# Altium project ECE453-F22-MCU.PrjPcb (part 3 of 3)

## Sheet 05_Analog.SchDoc
size A
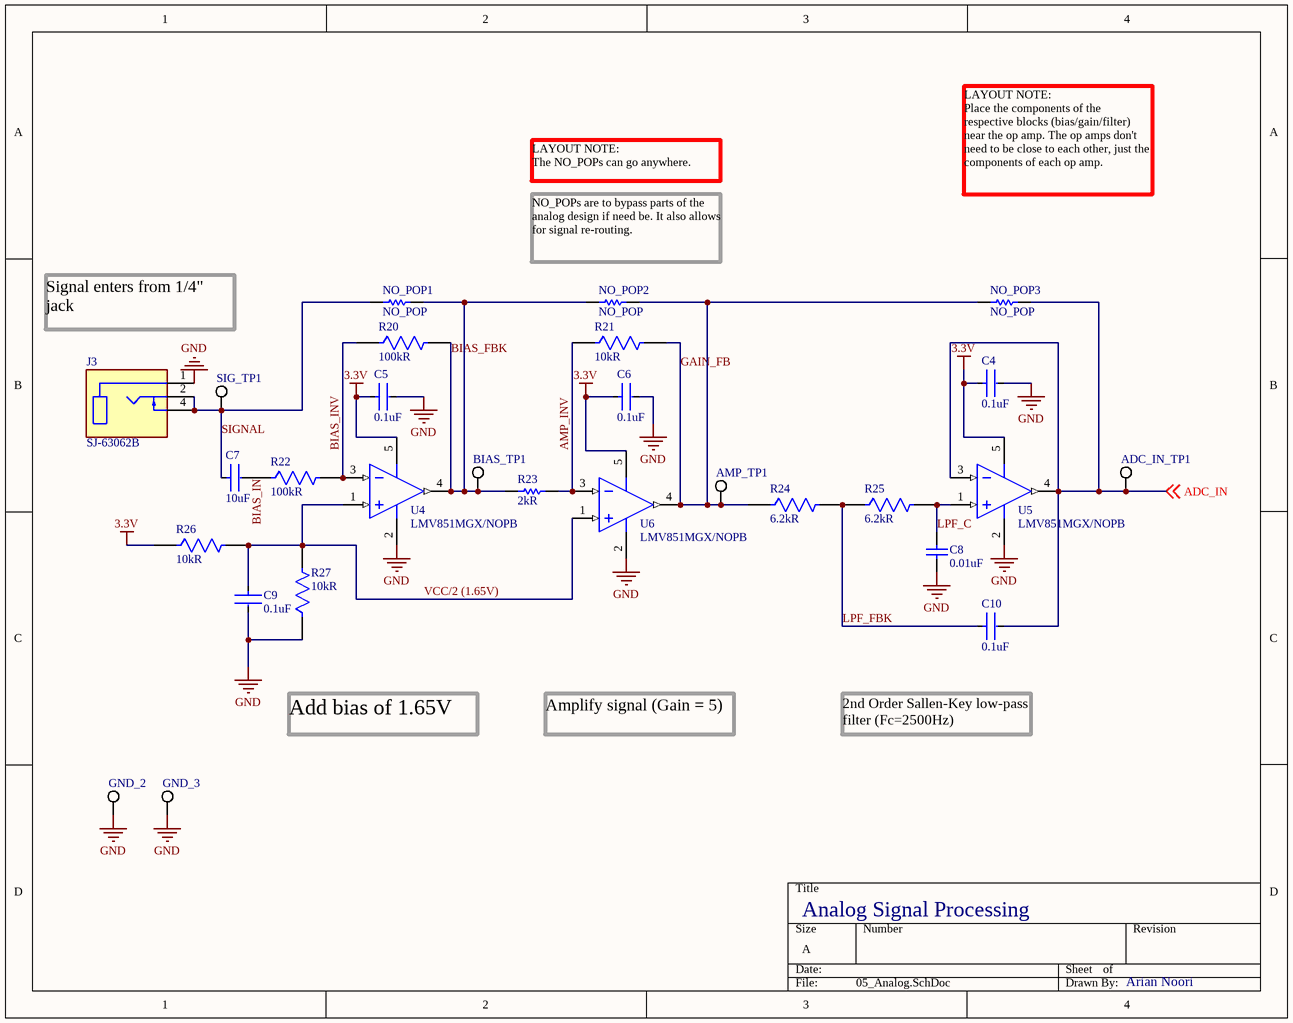
[diagram p4: 05_Analog.SchDoc]

### Parts
ADC_IN_TP1  5019  [KSTN-5019_V]  (value not drawn)
AMP_TP1  5019  [KSTN-5019_V]  (value not drawn)
BIAS_TP1  5019  [KSTN-5019_V]  (value not drawn)
C4  0.1uF  [FP-CL21-IPC_C]
C5  0.1uF  [FP-CL21-IPC_C]
C6  0.1uF  [FP-CL21-IPC_C]
C7  10uF  [FP-CL21-IPC_B]
C8  0.01uF  [CAPC2013X75X45LL10T25]
C9  0.1uF  [FP-CL21-IPC_C]
C10  0.1uF  [FP-CL21-IPC_C]
GND_2  5019  [KSTN-5019_V]  (value not drawn)
GND_3  5019  [KSTN-5019_V]  (value not drawn)
J3  SJ-63062B  [CUI_SJ-63062B]
NO_POP1  NO_POP  [RESC2013X60X35ML10T20]
NO_POP2  NO_POP  [RESC2013X60X35ML10T20]
NO_POP3  NO_POP  [RESC2013X60X35ML10T20]
R20  100kR  [FP-RT0805-MFG]
R21  10kR  [FP-RT0805-MFG]
R22  100kR  [FP-RT0805-MFG]
R23  2kR  [RESC2013X60X35LL10T20]
R24  6.2kR  [FP-RT0805-MFG]
R25  6.2kR  [FP-RT0805-MFG]
R26  10kR  [FP-RT0805-MFG]
R27  10kR  [FP-RT0805-MFG]
SIG_TP1  5019  [KSTN-5019_V]  (value not drawn)
U4  LMV851MGX/NOPB  [DCK0005A_N]
U5  LMV851MGX/NOPB  [DCK0005A_N]
U6  LMV851MGX/NOPB  [DCK0005A_N]

### Nets
3.3V: C4.1 C5.1 C6.1 R26.1 U4.5(V+) U5.5(V+) U6.5(V+)
GND: C4.2 C5.2 C6.2 C8.2 C9.2 GND_2.1 GND_3.1 J3.1(SLEEVE) R27.1 U4.2(V-) U5.2(V-) U6.2(V-)
ADC_IN: ADC_IN_TP1.1 C10.2 NO_POP3.2 U5.3(IN-) U5.4(OUT) ; off-sheet ADC_IN
AMP_INV: R21.1 R23.2 U6.3(IN-)
BIAS_FBK: BIAS_TP1.1 NO_POP1.2 NO_POP2.1 R20.2 R23.1 U4.4(OUT)
BIAS_IN: C7.2 R22.1
BIAS_INV: R20.1 R22.2 U4.3(IN-)
GAIN_FB: AMP_TP1.1 NO_POP2.2 NO_POP3.1 R21.2 R24.1 U6.4(OUT)
LPF_C: C8.1 R25.2 U5.1(IN+)
LPF_FBK: C10.1 R24.2 R25.1
SIGNAL: C7.1 J3.2(TIP) J3.4(TIP_SWITCH) NO_POP1.1 SIG_TP1.1
VCC/2 (1.65V): C9.1 R26.2 R27.2 U4.1(IN+) U6.1(IN+)

### Notes on the sheet
- LAYOUT NOTE:
  The NO_POPs can go anywhere.
- LAYOUT NOTE:
  Place the components of the respective blocks (bias/gain/filter) near the op amp. The op amps don't need to be close to each other, just the components of each op amp.
- (near NO_POP2) NO_POPs are to bypass parts of the analog design if need be. It also allows for signal re-routing.
- Signal enters from 1/4" jack
- Add bias of 1.65V
- Amplify signal (Gain = 5)
- 2nd Order Sallen-Key low-pass filter (Fc=2500Hz)
- Analog Signal Processing
- Arian Noori

### Library data of the parts
ADC_IN_TP1 AMP_TP1 BIAS_TP1 GND_2 GND_3 SIG_TP1 = CMP-1672-00008-1: Test Point, 1 Position SMD, RoHS, Tape and Reel; Manufacturer: Keystone Electronics; ComponentLink1Description: Manufacturer URL; Package Quantity: 1000; DatasheetVersion: 03/2014; Packaging: Tape and Reel; ComponentLink2URL: http://www.keyelco.com/product-pdf.cfm?p=1357; ComponentLink1URL: http://www.keyelco.com/; Mount: Surface Mount; Contact Plating: Silver; PackageDescription: 1-Pin Surface Mount Device, Body 3.81 x 2.03 mm; Pins: 1; RoHSCompliant: True; Mounting Technology: Surface Mount; ComponentLink2Description: Datasheet; PackageReference: 5019; Supplier 1: Digi-Key; Manufacturer Part Number: 5019; RoHS: Yes; Category: Connectors; Stock 1: 1295398; Pricing 1: 1=0.34000, 25=0.27360, 100=0.22340, 250=0.20064, 500=0.19152 (USD); Number of Pins: 1; Material: Bronze; Contact Material: Bronze; Termination: SMD/SMT; Series: 5019; Height: 0.09inch; REACH SVHC: No SVHC; RoHS Compliant: Yes; Lead Free: Lead Free; ComponentLink3URL: https://datasheet.ciiva.com/16318/m60-2p61-16318395.pdf?src-supplier=Future+Electronics; ComponentLink3Description: https://datasheet.ciiva.com/16318/m60-2p61-16318395.pdf?src-supplier=Future+Electronics; ComponentLink4URL: https://datasheet.ciiva.com/16885/70182998-16885945.pdf?src-supplier=Allied+Electronics; ComponentLink4Description: https://datasheet.ciiva.com/16885/70182998-16885945.pdf?src-supplier=Allied+Electronics; ComponentLink5URL: https://datasheet.ciiva.com/14848/m60-2p61-14848437.pdf?src-supplier=Digi-Key; ComponentLink5Description: https://datasheet.ciiva.com/14848/m60-2p61-14848437.pdf?src-supplier=Digi-Key; ComponentLink6URL: https://datasheet.ciiva.com/14848/m60-2p61-14848438.pdf?src-supplier=Digi-Key; ComponentLink6Description: https://datasheet.ciiva.com/14848/m60-2p61-14848438.pdf?src-supplier=Digi-Key; ComponentLink7URL: https://datasheet.ciiva.com/14848/m60-2p61-14848439.pdf?src-supplier=Digi-Key; ComponentLink7Description: https://datasheet.ciiva.com/14848/m60-2p61-14848439.pdf?src-supplier=Digi-Key
C4-C6 C9 C10 = CMP-2000-05017-2: CL21 Series 0805 100nF 50V ±10% Tolerance X7R Multilayer Ceramic Chip Capacitor; Manufacturer: Samsung; Manufacturer Part Number: CL21B104KBCNNNC; Depth: 1.25mm; Height: 0.85mm; Width: 0.049inch; Tolerance: 10%; Case Code (Metric): 2012; Case Code (Imperial): 0805; Material: Ceramic; Thickness: 0.037inch; Min Operating Temperature: -55°C; Contact Plating: Tin; Length: 2mm; Mount: Surface Mount; Voltage Rating (DC): 50V; Lead Free: Lead Free; Dielectric: X7R; Radiation Hardening: No; Capacitance: 100nF; Voltage Rating: 50V; Case/Package: 0805; Packaging: Tape and Reel; Max Operating Temperature: 125°C; Voltage: 50V; Supplier 1: Digi-Key; RoHS: Yes; Category: Ceramic Capacitors; Stock 1: 4599648; Pricing 1: 1=0.10000, 10=0.04400, 50=0.02400, 100=0.01960, 500=0.01404, 1000=0.01103 (USD); Series: CL; Construction: Flat; RoHS Compliant: Yes; ComponentLink1URL: https://datasheet.ciiva.com/25710/cl21b104kbcnnnc-25710182.pdf?src-supplier=Digi-Key; ComponentLink1Description: https://datasheet.ciiva.com/25710/cl21b104kbcnnnc-25710182.pdf?src-supplier=Digi-Key; ComponentLink2URL: https://datasheet.ciiva.com/29199/454152-da-01-en-vs-kondensator-0805-29199814.pdf?src-supplier=Conrad; ComponentLink2Description: https://datasheet.ciiva.com/29199/454152-da-01-en-vs-kondensator-0805-29199814.pdf?src-supplier=Conrad
C7 = CMP-2000-06103-2: CL21 Series 0805 10uF 10V ±10% Tolerance X5R Multilayer Ceramic Chip Capacitor; Manufacturer: Samsung; Manufacturer Part Number: CL21A106KPFNNNE; Case Code (Imperial): 0805; Capacitance: 10uF; Mount: Surface Mount; Depth: 1.25mm; Length: 2mm; Lead Free: Lead Free; Packaging: Tape and Reel; Dielectric: X5R; Width: 0.049inch; Package Quantity: 1; Height: 1.25mm; Case/Package: 0805; Voltage Rating: 10V; Thickness: 0.053inch; Max Operating Temperature: 85°C; Tolerance: 10%; Case Code (Metric): 2012; Contact Plating: Tin; Min Operating Temperature: -55°C; Radiation Hardening: No; Voltage Rating (DC): 10V; Supplier 1: Digi-Key; RoHS: Yes; Category: Ceramic Capacitors; Stock 1: 2691681; Pricing 1: 1=0.11000, 10=0.08100, 50=0.04420, 100=0.03610, 500=0.02580, 1000=0.02028 (USD); Series: CL; Construction: Flat; RoHS Compliant: Yes; ComponentLink1URL: https://media.digikey.com/pdf/Data%20Sheets/Samsung%20PDFs/CL_Series_MLCC_ds.pdf?src-supplier=Digi-Key; ComponentLink1Description: https://media.digikey.com/pdf/Data%20Sheets/Samsung%20PDFs/CL_Series_MLCC_ds.pdf?src-supplier=Digi-Key
C8 = CMP-2000-06105-1: Multilayer Ceramic Capacitor, 10 nF, 50 V, -55 to 125 degC, 2-Pin SMD, RoHS, Tape and Reel; Manufacturer: Samsung Electro-Mechanics; Manufacturer Part Number: CL21B103KBANNNC; Capacitance: 10000pF; Tolerance (%): ±10%; Dielectric: X7R; Rated Voltage: 50V; Tolerance: 10%; Package Description: 2-Pin Surface Mount Device, Body 2 x 1.25 mm; Datasheet Version: 11/2010; Package Reference: 0805; Case Size/Dimension: 0805; Datasheet URL: https://datasheet.ciiva.com/29199/455082-da-01-en-vs-kondensator-0805-29199459.pdf; Mounting Technology: SurfaceMount; Manufacturer URL: http://www.samsungsem.com/global/index.jsp; Supplier 1: Digi-Key; RoHS: Yes; Category: Ceramic Capacitors; Stock 1: 3435994; Pricing 1: 1=0.10000, 10=0.04200, 50=0.02300, 100=0.01880, 500=0.01344, 1000=0.01055 (USD); Mount: Surface Mount; Case/Package: 0805; Case Code (Metric): 2012; Case Code (Imperial): 0805; Material: Ceramic; Contact Plating: Tin; Min Operating Temperature: -55°C; Max Operating Temperature: 125°C; Voltage: 50V; Voltage Rating (DC): 50V; Packaging: Tape and Reel; Voltage Rating: 50V; Series: CL; Construction: Flat; Length: 2mm; Width: 0.049inch; Height: 0.65mm; Depth: 1.25mm; Thickness: 0.03inch; Radiation Hardening: No; Lead Free: Lead Free; RoHS Compliant: Yes; ComponentLink1URL: https://datasheet.ciiva.com/25709/cl21b103kbannnc-25709781.pdf?src-supplier=Digi-Key; ComponentLink1Description: https://datasheet.ciiva.com/25709/cl21b103kbannnc-25709781.pdf?src-supplier=Digi-Key; ComponentLink2URL: https://datasheet.ciiva.com/29199/455082-da-01-en-vs-kondensator-0805-29199459.pdf?src-supplier=Conrad; ComponentLink2Description: https://datasheet.ciiva.com/29199/455082-da-01-en-vs-kondensator-0805-29199459.pdf?src-supplier=Conrad
J3 = SJ-63062B: 6.35 mm, Mono and Stereo, Right Angle, Through Hole, 2~3 Conductors, 0~1 Internal Switches, Audio Jack Connector; Manufacturer: CUI Devices; Package: None; Price: None; Value: *; MP: SJ-63062B; Availability: Unavailable; Supplier 1: Digi-Key; Manufacturer Part Number: SJ-63062B; RoHS: Yes; Category: Audio / Video Connectors; Stock 1: 732; Pricing 1: 1=2.09000, 10=1.82100, 25=1.74360, 50=1.70500, 150=1.62747, 300=1.47250, 600=1.35625, 1050=1.16250, 2550=1.08500 (USD)
NO_POP1-NO_POP3 = CMP-2100-03673-1: Chip Resistor, 0 Ohm, Jumper, +/- 5%, 0.125 W, -55 to 155 degC, 0805 (2012 Metric), RoHS, Tape and Reel; Manufacturer: Yageo; Manufacturer Part Number: RC0805JR-070RL; Power Rating: 125mW; Resistance: 0mOhm; Voltage Rating (DC): 150V; Temperature Coefficient: 200ppm/degreesC; Height: 0.5mm; Depth: 1.25mm; Case Code (Imperial): 0805; Lead Free: LeadFree; Military Standard: Not; Package Description: 2-Pin Surface Mounted Device, Body 2 x 1.25 mm; Case Code (Metric): 2012; Composition: ThickFilm; Voltage Rating: 150V; Manufacturer URL: http://www.yageo.com/; Packaging: TapeandReel; Package Reference: 0805; REACH SVHC: Unknown; Tolerance: 5%; Case/Package: 0805; Max Operating Temperature: 155degC; Number of Pins: 2; Min Operating Temperature: -55degC; RoHSCompliant: true; Length: 2mm; Datasheet URL: http://www.yageo.com/NewPortal/yageodocoutput?fileName=/pdf/R-Chip/PYu-RC_Group_51_RoHS_L_5.pdf; Termination: SMD/SMT; Radiation Hardening: No; Width: 1.25mm; Contact Plating: Tin; Datasheet Version: Rev. 5, 10/2016; Supplier 1: Digi-Key; RoHS: Yes; Category: Chip SMD Resistors; Stock 1: 3029531; Pricing 1: 1=0.10000, 10=0.03100, 25=0.02280, 50=0.01720, 100=0.01280, 250=0.00972, 500=0.00778, 1000=0.00573 (USD); Size Code: 0805; Resistor Type: Thick Film; Features: Moisture Resistant; Series: RC; Max Power Dissipation: 125mW; Number of Terminations: 2; Construction: Rectangular; Technology: THICK FILM; Resistance Tolerance: 5%; RoHS Compliant: Yes; ComponentLink1URL: https://datasheet.ciiva.com/11819/0900766b8106beab-11819430.pdf?src-supplier=RSComponents; ComponentLink1Description: https://datasheet.ciiva.com/11819/0900766b8106beab-11819430.pdf?src-supplier=RSComponents; ComponentLink2URL: https://datasheet.ciiva.com/7941/1738694-7941861.pdf?src-supplier=Element14; ComponentLink2Description: https://datasheet.ciiva.com/7941/1738694-7941861.pdf?src-supplier=Element14; ComponentLink3URL: https://datasheet.ciiva.com/7941/1738694-7941862.pdf?src-supplier=Element14; ComponentLink3Description: https://datasheet.ciiva.com/7941/1738694-7941862.pdf?src-supplier=Element14; ComponentLink4URL: https://datasheet.ciiva.com/7941/1738694-7941863.pdf?src-supplier=Element14; ComponentLink4Description: https://datasheet.ciiva.com/7941/1738694-7941863.pdf?src-supplier=Element14; ComponentLink5URL: https://datasheet.ciiva.com/15190/getdatasheetpartid-330685-15190028.pdf?src-supplier=Verical; ComponentLink5Description: https://datasheet.ciiva.com/15190/getdatasheetpartid-330685-15190028.pdf?src-supplier=Verical
R20 R22 = CMP-03412-020019-1: RES 100K OHM 1/8W .5% SMD 0805; Manufacturer Part Number: RT0805DRE07100KL; Manufacturer: Yageo; Temperature Coefficient: 50 ppm/°C; Resistance: 100KΩ; Value: 100KΩ; Voltage Rating: 150V; Power Rating: 0.125W; Tolerance: 0.01; Max Power Dissipation: 125mW; Device Class L1: Passive Components; Automotive: No; Ipc Land Pattern Name: RESC200125X50; Series: RT; Digikey Description: RES 100K OHM 1/8W .5% SMD 0805; Temperature Range High: +155°C; Footprint Url: http://www.yageo.com/exep/pages/download/literatures/PYu-R_Mount_10.pdf; Octopart: https://octopart.com/rt0805dre07100kl-yageo-1433075; Lead Free: Yes; Temperature Range Low: -55°C; ComponentLink2Description: Datasheet; Device Class L2: Resistors; Height: 0.6mm; Device Class L3: Chip SMD Resistors; Composition: Thin Film; Package: RT0805; RoHS: TRUE; Temperature: -55°C to +155°C; Category: Res; ComponentLink2URL: http://www.yageo.com/documents/recent/PYu-RT_1-to-0.01_RoHS_L_9.pdf; Supplier 1: Digi-Key; Stock 1: 19530; Pricing 1: 1=0.13000, 10=0.11500, 100=0.04430, 1000=0.01947, 2500=0.01682 (USD); Case/Package: 0805; Case Code (Metric): 2012; Case Code (Imperial): 0805; Min Operating Temperature: -55°C; Max Operating Temperature: 155°C; Packaging: Tape and Reel; Resistor Type: Thin Film; Number of Terminations: 2; Voltage Rating (DC): 150V; Features: Moisture Resistant; Length: 0.079inch; Width: 0.049inch; RoHS Compliant: Yes; ComponentLink1URL: http://www.yageo.com/documents/recent/PYu-RT_1-to-0.01_RoHS_L_9.pdf?src-supplier=Digi-Key; ComponentLink1Description: http://www.yageo.com/documents/recent/PYu-RT_1-to-0.01_RoHS_L_9.pdf?src-supplier=Digi-Key
R21 R26 R27 = CMP-2001-01785-2: RES 10.0K OHM 1/8W .5% SMD 0805; Manufacturer: Yageo; Manufacturer Part Number: RT0805DRE0710KL; Value: 10KΩ; Voltage Rating: 150V; Tolerance: 0.01; Temperature Coefficient: 50 ppm/°C; Power Rating: 0.125W; Max Power Dissipation: 125mW; Series: RT; Device Class L2: Resistors; Ipc Land Pattern Name: RESC200125X50; Temperature: -55°C to +155°C; Height: 0.6mm; Composition: Thin Film; Automotive: No; Resistance: 10KΩ; Footprint Url: http://www.yageo.com/exep/pages/download/literatures/PYu-R_Mount_10.pdf; Package: RT0805; Device Class L1: Passive Components; Octopart: https://octopart.com/rt0805dre0710kl-yageo-1180739; Mouser Description: Res Thin Film 0805 10K Ohm 0.5% 1/8W ±50ppm/°C Molded SMD Paper T/R; Temperature Range Low: -55°C; Category: Res; RoHS: TRUE; Device Class L3: Chip SMD Resistors; ComponentLink2Description: Datasheet; Lead Free: Yes; Temperature Range High: +155°C; Digikey Description: RES 10.0K OHM 1/8W .5% SMD 0805; ComponentLink2URL: http://www.yageo.com/documents/recent/PYu-RT_1-to-0.01_RoHS_L_9.pdf; Supplier 1: Digi-Key; Stock 1: 92996; Pricing 1: 1=0.13000, 10=0.11500, 100=0.04430, 1000=0.01947, 2500=0.01682 (USD); Case/Package: 0805; Case Code (Imperial): 0805; Case Code (Metric): 2012; Weight: 0.000194oz; Size Code: 0805; Min Operating Temperature: -55°C; Max Operating Temperature: 125°C; Packaging: Tape and Reel; Resistor Type: Thin Film; Termination: SMD/SMT; Number of Terminations: 2; Package Quantity: 5000; Voltage Rating (DC): 150V; Features: Moisture Resistant; Construction: Rectangular; Length: 2mm; Width: 1.25mm; Depth: 1.25mm; Military Standard: Not; RoHS Compliant: Yes; ComponentLink1URL: http://www.mouser.com/ds/2/447/yageodocoutput-1125656.pdf?src-supplier=Mouser; ComponentLink1Description: http://www.mouser.com/ds/2/447/yageodocoutput-1125656.pdf?src-supplier=Mouser; ComponentLink3URL: http://www.yageo.com/documents/recent/PYu-RT_1-to-0.01_RoHS_L_9.pdf?src-supplier=Digi-Key; ComponentLink3Description: http://www.yageo.com/documents/recent/PYu-RT_1-to-0.01_RoHS_L_9.pdf?src-supplier=Digi-Key; ComponentLink4URL: http://www.yageo.com/documents/recent/PYu-RT_1-to-0.05_RoHS_L_(4).pdf?src-supplier=Future+Electronics; ComponentLink4Description: http://www.yageo.com/documents/recent/PYu-RT_1-to-0.05_RoHS_L_(4).pdf?src-supplier=Future+Electronics
R23 = CMP-2001-01475-1: RES 2K OHM 1/8W .5% SMD 0805; Part Number: RT0805FRE072KL; Manufacturer: Yageo; Tolerance: 1%; Power Rating: 125mW; Voltage Rating: 150V; Temperature Coefficient: 50ppm/°C; Supplier 1: Digi-Key; Manufacturer Part Number: RT0805FRE072KL; RoHS: Yes; Category: Chip SMD Resistors; Stock 1: 19626; Pricing 1: 1=0.10000, 10=0.08400, 100=0.03250, 1000=0.01430, 2500=0.01235 (USD); Case/Package: 0805; Case Code (Metric): 2012; Case Code (Imperial): 0805; Weight: 0.000194oz; Contact Plating: Tin,Lead,Matte; Min Operating Temperature: -55°C; Max Operating Temperature: 125°C; Resistance: 2kR; Packaging: Tape and Reel; Package Quantity: 5000; Resistor Type: Thin Film; Number of Terminations: 2; Termination: SMD/SMT; Max Power Dissipation: 125mW; Voltage Rating (DC): 150V; Features: Moisture Resistant; Series: RT; Construction: Rectangular; Length: 2mm; Width: 0.049inch; Height: 0.024inch; Depth: 1.25mm; Radiation Hardening: No; Military Standard: Not; Lead Free: Lead Free; RoHS Compliant: Yes; ComponentLink1URL: https://datasheet.ciiva.com/12811/pyu-rt-1-to-0-05-rohs-l-4-12811661.pdf?src-supplier=Mouser; ComponentLink1Description: https://datasheet.ciiva.com/12811/pyu-rt-1-to-0-05-rohs-l-4-12811661.pdf?src-supplier=Mouser; ComponentLink2URL: https://datasheet.ciiva.com/2561/pyu-rt-1-to-0-05-rohs-l-5-2561141.pdf?src-supplier=Digi-Key; ComponentLink2Description: https://datasheet.ciiva.com/2561/pyu-rt-1-to-0-05-rohs-l-5-2561141.pdf?src-supplier=Digi-Key
R24 R25 = CMP-2001-01500-2: RES SMD 6.2K OHM 1% 1/8W 0805; Manufacturer Part Number: RT0805FRE076K2L; Manufacturer: Yageo; Temperature Coefficient: 50 ppm/°C; Power Rating: 0.125W; Tolerance: 0.0001; Voltage Rating: 150V; Resistance: 6.2KΩ; Value: 6.2KΩ; Max Power Dissipation: 125mW; RoHS: TRUE; Series: RT; Lead Free: Yes; Footprint Url: http://www.yageo.com/exep/pages/download/literatures/PYu-R_Mount_10.pdf; Device Class L1: Passive Components; Temperature Range High: +155°C; Device Class L2: Resistors; Automotive: No; Ipc Land Pattern Name: RESC200125X50; ComponentLink2Description: Datasheet; Temperature Range Low: -55°C; Height: 0.6mm; Digikey Description: RES SMD 6.2K OHM 1% 1/8W 0805; Category: Res; Octopart: https://octopart.com/rt0805fre076k2l-yageo-1397874; Temperature: -55°C to +155°C; Composition: Thin Film; ComponentLink2URL: http://www.yageo.com/documents/recent/PYu-RT_1-to-0.01_RoHS_L_9.pdf; Device Class L3: Chip SMD Resistors; Package: RT0805; Supplier 1: Digi-Key; Stock 1: 49588; Pricing 1: 1=0.10000, 10=0.08400, 100=0.03250, 1000=0.01430, 2500=0.01235 (USD); Case/Package: 0805; Contact Plating: Tin,Matte; Min Operating Temperature: -55°C; Max Operating Temperature: 125°C; Package Quantity: 5000; Packaging: Tape and Reel; Resistor Type: Thin Film; Number of Terminations: 2; Voltage Rating (DC): 150V; Construction: Rectangular; Length: 0.079inch; Width: 0.049inch; Depth: 1.25mm; Radiation Hardening: No; Military Standard: Not; RoHS Compliant: Yes; ComponentLink1URL: https://datasheet.ciiva.com/2561/pyu-rt-1-to-0-05-rohs-l-5-2561365.pdf?src-supplier=Digi-Key; ComponentLink1Description: https://datasheet.ciiva.com/2561/pyu-rt-1-to-0-05-rohs-l-5-2561365.pdf?src-supplier=Digi-Key
U4-U6 = CMP-0055-01104-3: Single 8 MHz Low Power CMOS, EMI Hardened Operational Amplifier, 5-pin SC-70, Pb-Free; Manufacturer: Texas Instruments; PackageTopMarking: A98*XTT; CompType: Amplifiers; PowerWise: Y; Slew Rate: 4.5V/µs; Common Mode Rejection Ratio: 77dB; Number of Channels: 1; Output Current: 30mA; Nominal Supply Current: 400uA; Min Supply Voltage: 2.7V; Max Supply Voltage: 5.5V; Voltage Gain: 120dB; Gain Bandwidth Product: 8MHz; Input Bias Current: 0.1pA; Input Offset Voltage (Vos): 260uV; Operating Supply Current: 430uA; Output Current per Channel: 65mA; Amplifier Type: GENERAL PURPOSE; Code_IPC: SOT353-5; Code_JEITA: SC-88A; Package Reference: DCK0005A; PinCount: 5; Code_JEDEC: MO-203-AA; RoHS: Y; PackageDescription: Molded SC-70, 2 x 1.25 x .9mm, 5 Lead, 0.65mm Pitch; ComponentLink1Description: Datasheet URL; ComponentLink1URL: http://www.ti.com/general/docs/lit/getliterature.tsp?genericPartNumber=LMV851&fileType=pdf; Supplier 1: Digi-Key; Manufacturer Part Number: LMV851MGX/NOPB; Category: Amplifiers - Op Amps, Buffer, Instrumentation; Stock 1: 2870; Pricing 1: 1=2.08000, 10=1.87100, 25=1.76480, 100=1.50370, 250=1.41192, 500=1.23544, 1000=1.06560 (USD); Mount: Surface Mount; Case/Package: SC; Number of Pins: 5; Min Operating Temperature: -40°C; Max Operating Temperature: 125°C; Packaging: Tape and Reel; Package Quantity: 1; Number of Circuits: 1; Series: PowerWise®; Supply Current: 400uA; Technology: CMOS; Radiation Hardening: No; Lead Free: Lead Free; RoHS Compliant: Yes; ComponentLink2URL: https://datasheet.ciiva.com/14460/lmv851-14460668.pdf?src-supplier=Avnet; ComponentLink2Description: https://datasheet.ciiva.com/14460/lmv851-14460668.pdf?src-supplier=Avnet; ComponentLink3URL: https://datasheet.ciiva.com/6627/lmv851-6627003.pdf?src-supplier=Digi-Key; ComponentLink3Description: https://datasheet.ciiva.com/6627/lmv851-6627003.pdf?src-supplier=Digi-Key; ComponentLink4URL: https://datasheet.ciiva.com/6626/lmv851-6626998.pdf?src-supplier=Digi-Key; ComponentLink4Description: https://datasheet.ciiva.com/6626/lmv851-6626998.pdf?src-supplier=Digi-Key

## Nets that join several sheets
3.3V: 02-MCU (13 pins), 03_Power_Delivery (3.3V_TP.1 C1.1 U1.2 U3.3), 04_LCD (C2.2 C3.2 J2.2), 05_Analog (7 pins)
GND: 02-MCU (20 pins), 03_Power_Delivery (8 pins), 04_LCD (C2.1 C3.1 J2.1 J2.40), 05_Analog (12 pins)
3.3V_RST_R: 02-MCU (U200.1), 03_Power_Delivery (R2.2 U3.2)
/WR(D/C): 02-MCU (MD200.34), 04_LCD (R6.2)
ADC_IN: 02-MCU (MD200.10), 05_Analog (5 pins)
BL_ON/OFF: 02-MCU (MD200.41), 04_LCD (R10.2)
CTP_INT: 02-MCU (MD200.38), 04_LCD (R19.2)
CTP_SCL: 02-MCU (MD200.39), 04_LCD (R9.2)
CTP_SDA: 02-MCU (MD200.40), 04_LCD (R12.2)
FLASH_/CS: 02-MCU (MD200.20), 04_LCD (R18.2)
FLASH_/WP: 02-MCU (MD200.35), 04_LCD (R17.2)
FONT_/CS: 02-MCU (MD200.19), 04_LCD (R15.2)
LCD_/CS: 02-MCU (MD200.9), 04_LCD (R5.2)
LCD_RESET: 02-MCU (MD200.37), 04_LCD (R3.2)
SCLK(D/C(SCL)): 02-MCU (MD200.21), 04_LCD (R4.2 R14.2)
SD_/CS: 02-MCU (MD200.14), 04_LCD (R16.2)
SDI(LCD_SDI): 02-MCU (MD200.17), 04_LCD (R8.2 R13.2)
SDO(LCD_SDO): 02-MCU (MD200.18), 04_LCD (R7.2 R11.2)